# Altium schematic sheet E1.SchDoc
size 420 x 297 mm; SheetNumber: 1; SheetTotal: 1
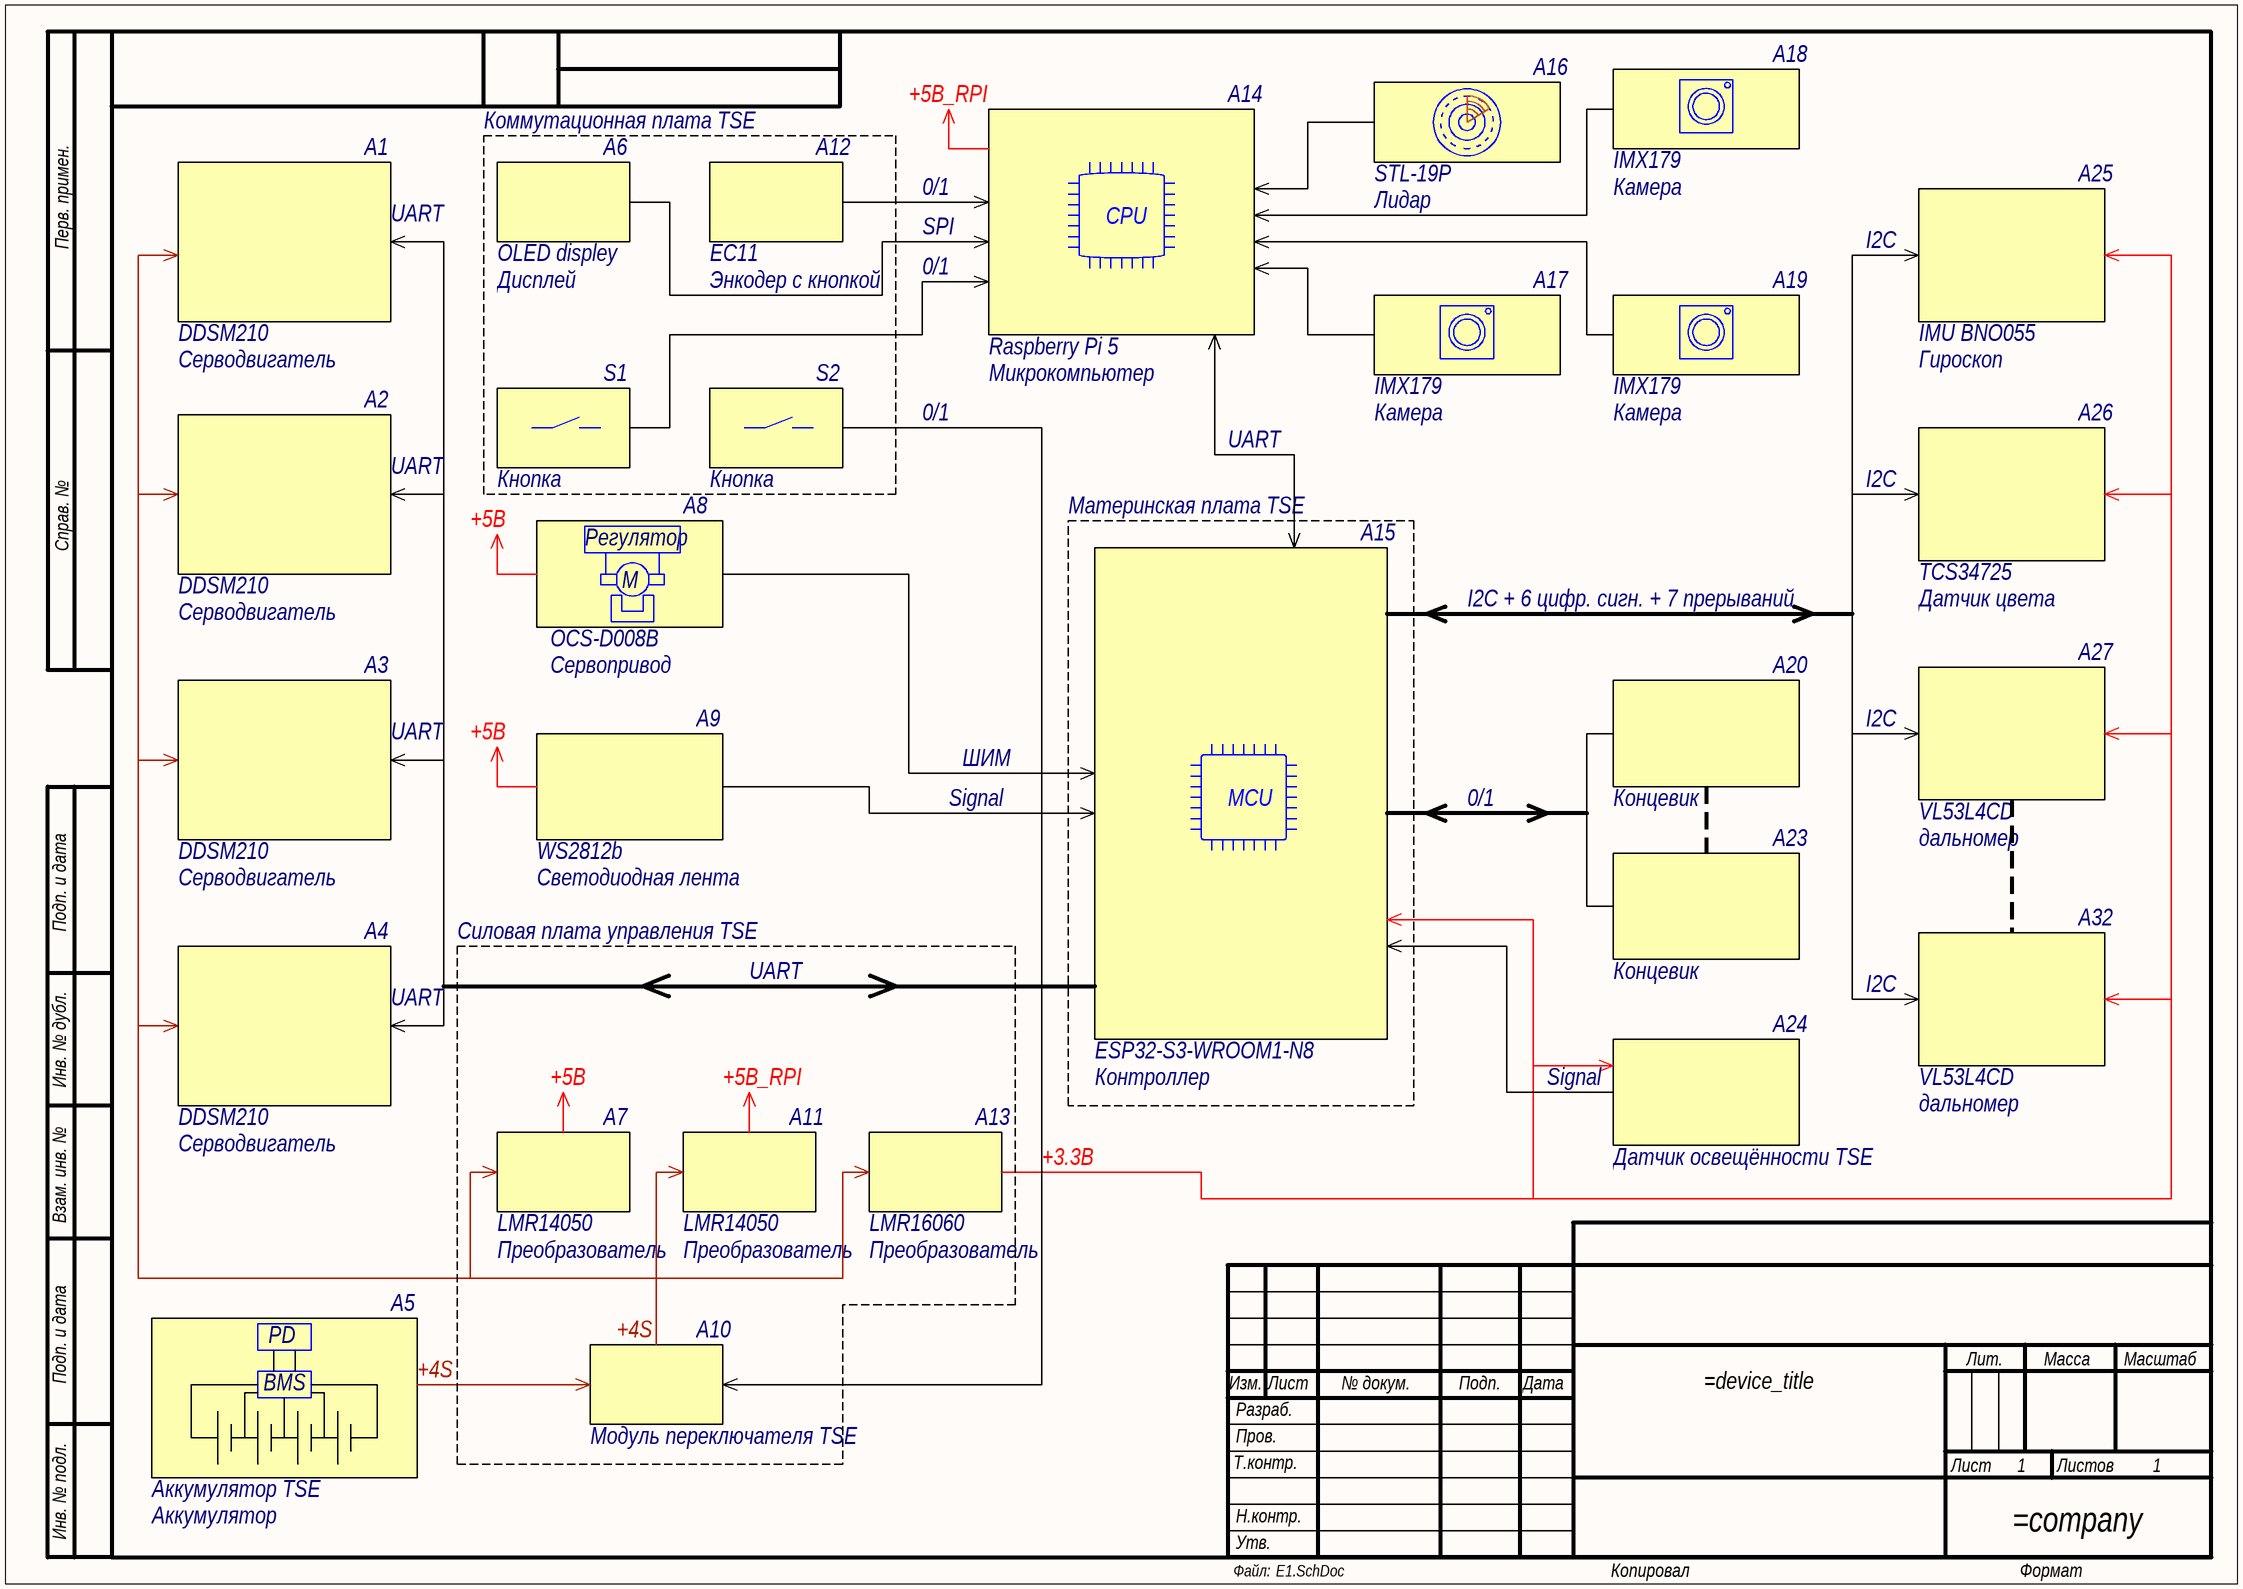
[diagram p0: E1.SchDoc]

## Parts
A1  Обозначение: DDSM210  Наименование: Серводвигатель  (hidden comment: Устройство)
A2  Обозначение: DDSM210  Наименование: Серводвигатель  (hidden comment: Устройство)
A3  Обозначение: DDSM210  Наименование: Серводвигатель  (hidden comment: Устройство)
A4  Обозначение: DDSM210  Наименование: Серводвигатель  (hidden comment: Устройство)
A5  Обозначение: Аккумулятор TSE  Наименование: Аккумулятор  (hidden comment: Устройство)
A6  Обозначение: OLED displey  Наименование: Дисплей  (hidden comment: Устройство)
A7  Обозначение: LMR14050  Наименование: Преобразователь  (hidden comment: Устройство)
A8  Обозначение: OCS-D008B  Наименование: Сервопривод  (hidden comment: Устройство)
A9  Обозначение: WS2812b  Наименование: Светодиодная лента  (hidden comment: Устройство)
A10  Наименование: Модуль переключателя TSE  (hidden comment: Устройство)
A11  Обозначение: LMR14050  Наименование: Преобразователь  (hidden comment: Устройство)
A12  Обозначение: EC11  Наименование: Энкодер с кнопкой  (hidden comment: Устройство)
A13  Обозначение: LMR16060  Наименование: Преобразователь  (hidden comment: Устройство)
A14  Обозначение: Raspberry Pi 5  Наименование: Микрокомпьютер  (hidden comment: Устройство)
A15  Обозначение: ESP32-S3-WROOM1-N8  Наименование: Контроллер  (hidden comment: Устройство)
A16  Обозначение: STL-19P  Наименование: Лидар  (hidden comment: Устройство)
A17  Обозначение: IMX179  Наименование: Камера  (hidden comment: Устройство)
A18  Обозначение: IMX179  Наименование: Камера  (hidden comment: Устройство)
A19  Обозначение: IMX179  Наименование: Камера  (hidden comment: Устройство)
A20  Наименование: Концевик  (hidden comment: Устройство)
A23  Наименование: Концевик  (hidden comment: Устройство)
A24  Наименование: Датчик освещённости TSE  (hidden comment: Устройство)
A25  Обозначение: IMU BNO055  Наименование: Гироскоп  (hidden comment: Устройство)
A26  Обозначение: TCS34725  Наименование: Датчик цвета  (hidden comment: Устройство)
A27  Обозначение: VL53L4CD  Наименование: дальномер  (hidden comment: Устройство)
A32  Обозначение: VL53L4CD  Наименование: дальномер  (hidden comment: Устройство)
S1  Обозначение: Кнопка  (hidden comment: Переключатель)
S2  Обозначение: Кнопка  (hidden comment: Переключатель)

## Blocks framed on the sheet
Коммутационная плата TSE: A6 A12 S1 S2

## Notes on the sheet
- +5В_RPI
- (near A1) UART
- 0/1
- SPI
- CPU
- I2C
- UART
- (near A2) UART
- +5В
- (near A15) Материнская плата TSE
- (near A8) Регулятор
- М
- I2C + 6 цифр. сигн. + 7 прерываний
- (near A3) UART
- ШИМ
- Signal
- MCU
- Силовая плата управления TSE
- (near A4) UART
- (near A7) +5В
- (near A11) +5В_RPI
- +3.3В
- (near A10) +4S
- BMS
- PD
- (near A5) +4S
- Перв. примен.
- Справ. №
- Подп. и дата
- Инв. № дубл.
- Взам. инв. №
- Изм.
- Лист
- № докум.
- Подп.
- Дата
- Лит.
- Масса
- Масштаб
- Т.контр.
- Пров.
- Разраб.
- Листов
- Инв. № подл.
- Н.контр.
- Файл:
- Утв.
- Копировал
- Формат